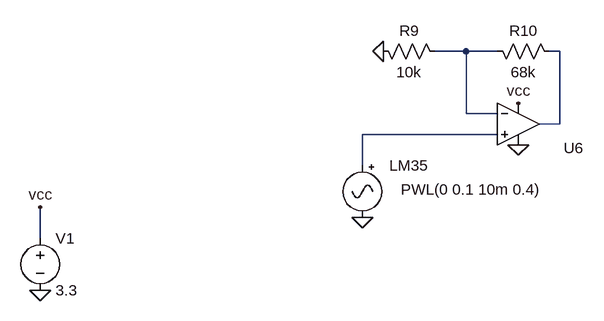
[diagram p0: schematic LM35AFE.asc]
LM35AFE.asc, the LTspice schematic file:
Version 4
SHEET 1 5656 680
WIRE 784 -176 736 -176
WIRE 832 -176 784 -176
WIRE 928 -176 912 -176
WIRE 784 -80 784 -176
WIRE 832 -80 784 -80
WIRE 928 -64 928 -176
WIRE 928 -64 896 -64
WIRE 832 -48 624 -48
WIRE 624 0 624 -48
WIRE 128 112 128 64
FLAG 128 192 0
FLAG 128 64 vcc
FLAG 864 -96 vcc
FLAG 864 -32 0
FLAG 624 80 0
FLAG 656 -176 0
SYMBOL Voltage 128 96 R0
SYMATTR InstName V1
SYMATTR Value 3.3
SYMBOL UniversalOpAmp 864 -64 R0
WINDOW 0 70 37 Left 2
SYMATTR InstName U6
SYMBOL Misc\\signal 624 -16 M0
WINDOW 3 -276 53 Left 2
WINDOW 123 0 0 Left 0
WINDOW 39 0 0 Left 0
WINDOW 0 -102 16 Left 2
SYMATTR Value PWL(0 0.1 10m 0.4)
SYMATTR InstName LM35
SYMBOL res 752 -160 M270
WINDOW 0 32 56 VTop 2
WINDOW 3 0 56 VBottom 2
SYMATTR InstName R9
SYMATTR Value 10k
SYMBOL res 928 -160 M270
WINDOW 0 32 56 VTop 2
WINDOW 3 0 56 VBottom 2
SYMATTR InstName R10
SYMATTR Value 68k

The netlist it stands for:
* LM35AFE.asc
V1 vcc 0 3.3
XU6 N003 N001 vcc 0 N002 level1 Avol=1Meg GBW=10Meg Vos=0 En=0 Enk=0 In=0 Ink=0 Rin=500Meg  ; pins In+ In- V+ V- OUT
V§LM35 N003 0 PWL(0 0.1 10m 0.4)
R9 N001 0 10k
R10 N002 N001 68k
.lib UniversalOpAmp1.lib
.backanno
.end